# Altium schematic sheet GT_16u2_Rev2.SchDoc
size A
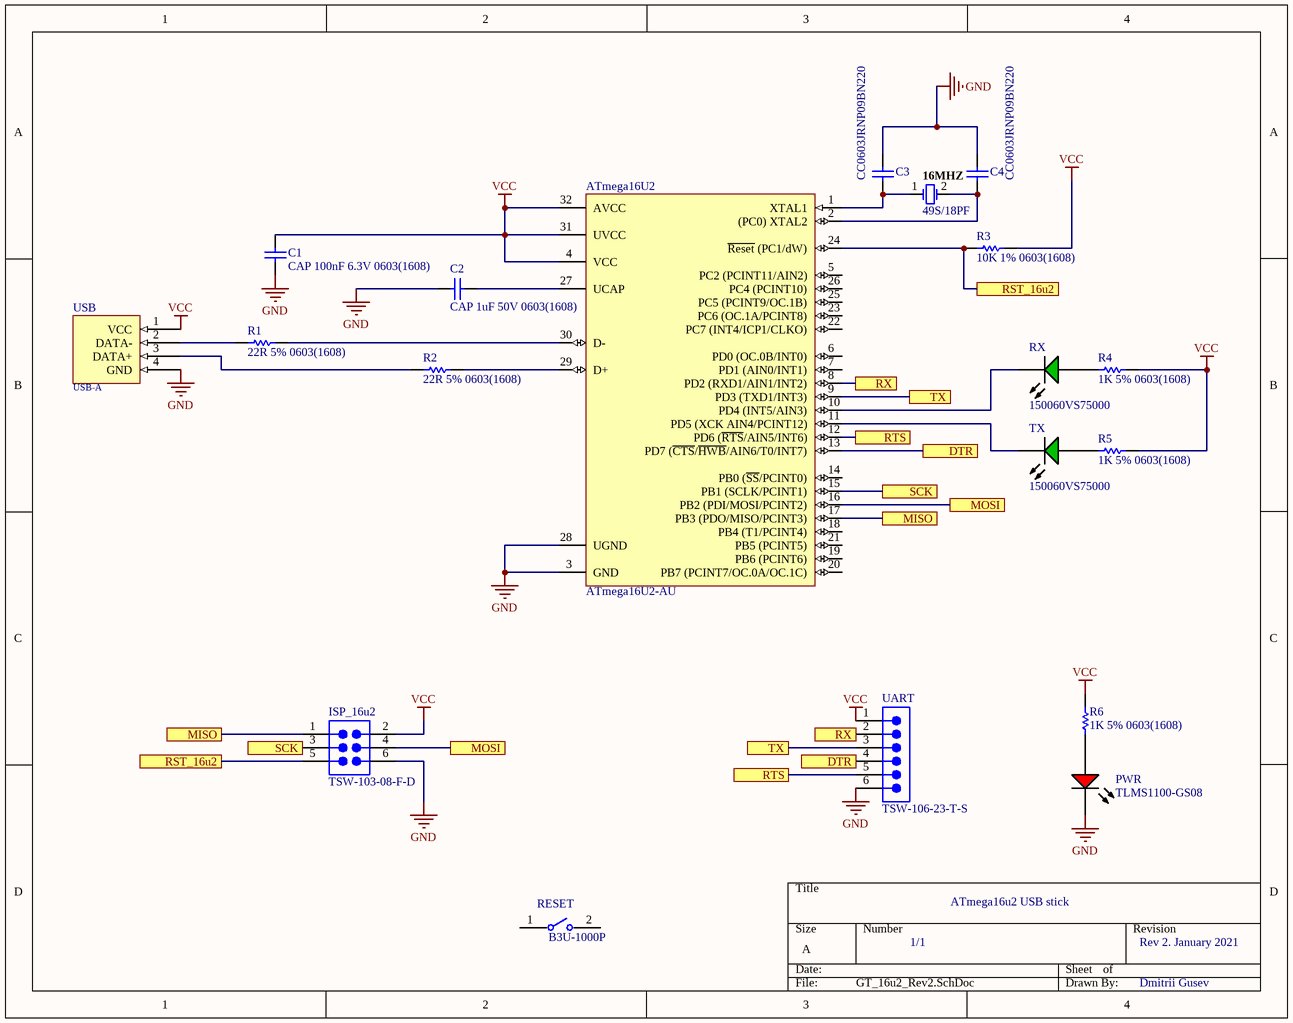
[diagram p0: GT_16u2_Rev2.SchDoc]

## Parts
16MHZ  49S/18PF  [JPY-49S-18PF]
ATmega16U2  ATmega16U2-AU  [32A_M]
C1  CAP 100nF 6.3V 0603(1608)  [CAPC0603(1608)100_L]
C2  CAP 1uF 50V 0603(1608)  [CAPC0603(1608)100_N]
C3  CC0603JRNP09BN220  [CAPC1608X90X40ML10T20]
C4  CC0603JRNP09BN220  [CAPC1608X90X40ML10T20]
ISP_16u2  TSW-103-08-F-D  [SMTC-TSW-103-08-X-D]
PWR  TLMS1100-GS08  [VISH-TLMX1100_V]
R1  22R 5% 0603(1608)  [RESC0603(1608)_N]
R2  22R 5% 0603(1608)  [RESC0603(1608)_N]
R3  10K 1% 0603(1608)  [RESC0603(1608)_N]
R4  1K 5% 0603(1608)  [RESC0603(1608)_L]
R5  1K 5% 0603(1608)  [RESC0603(1608)_L]
R6  1K 5% 0603(1608)  [RESC0603(1608)_L]
RESET  B3U-1000P  [FP-B3U-1000P-MFG]
RX  150060VS75000  [WE-150060VS75000_V]
TX  150060VS75000  [WE-150060VS75000_V]
UART  TSW-106-23-T-S  [SMTC-TSW-106-23-X-S]
USB  USB-A  [USB A]

## Ports
DTR, MISO, MOSI, RST_16u2, RTS, RX, SCK, TX

## Nets
GND: ATmega16U2.3(GND) ATmega16U2.28(UGND) C1.1 C2.1 C3.2 C4.2 ISP_16u2.6 PWR.2(K) UART.6 USB.4(GND)
VCC: ATmega16U2.4(VCC) ATmega16U2.31(UVCC) ATmega16U2.32(AVCC) C1.2 ISP_16u2.2 R3.2 R4.2 R5.2 R6.2 UART.1 USB.1(VCC)
DTR: ATmega16U2.13(PD7_(~{CTS}/~{HWB}/AIN6/T0/INT7)) UART.4 ; port DTR
MISO: ATmega16U2.17(PB3_(PDO/MISO/PCINT3)) ISP_16u2.1 ; port MISO
MOSI: ATmega16U2.16(PB2_(PDI/MOSI/PCINT2)) ISP_16u2.4 ; port MOSI
RST_16u2: ATmega16U2.24(~{Reset}_(PC1/dW)) ISP_16u2.5 R3.1 ; port RST_16u2
RTS: ATmega16U2.12(PD6_(~{RTS}/AIN5/INT6)) UART.5 ; port RTS
RX: ATmega16U2.8(PD2_(RXD1/AIN1/INT2)) UART.2 ; port RX
SCK: ATmega16U2.15(PB1_(SCLK/PCINT1)) ISP_16u2.3 ; port SCK
TX: ATmega16U2.9(PD3_(TXD1/INT3)) UART.3 ; port TX
Net16MHZ_1: 16MHZ.1 ATmega16U2.1(XTAL1) C3.1
Net16MHZ_2: 16MHZ.2 ATmega16U2.2((PC0)_XTAL2) C4.1
NetATmega16U2_10: ATmega16U2.10(PD4_(INT5/AIN3)) RX.1(K)
NetATmega16U2_11: ATmega16U2.11(PD5_(XCK_AIN4/PCINT12)) TX.1(K)
NetATmega16U2_27: ATmega16U2.27(UCAP) C2.2
NetATmega16U2_29: ATmega16U2.29(D+) R2.2
NetATmega16U2_30: ATmega16U2.30(D-) R1.2
NetPWR_1: PWR.1(A) R6.1
NetR1_1: R1.1 USB.2(DATA-)
NetR2_1: R2.1 USB.3(DATA+)
NetR4_1: R4.1 RX.2(A)
NetR5_1: R5.1 TX.2(A)

Not connected (* = marked no-connect by the designer): ATmega16U2 5(PC2_(PCINT11/AIN2)) 6(PD0_(OC.0B/INT0)) 7(PD1_(AIN0/INT1)) 14(PB0_(~{SS}/PCINT0)) 18(PB4_(T1/PCINT4)) 19(PB6_(PCINT6)) 20(PB7_(PCINT7/OC.0A/OC.1C)) 21(PB5_(PCINT5)) 22(PC7_(INT4/ICP1/CLKO)) 23(PC6_(OC.1A/PCINT8)) 25(PC5_(PCINT9/OC.1B)) 26(PC4_(PCINT10)); RESET 1 2

## Notes on the sheet
- ATmega16u2 USB stick
- 1/1
- Rev 2. January 2021
- Dmitrii Gusev

## Library data of the parts
16MHZ = CMP-2100-03581-1: Crystal, 16 MHz, 18 pF, -20 to 70 degC, 2-Pin THD; Manufacturer: Shenzhen Jingpengyuan; Package Description: 2-Pin Through Hole Device, Body 11.05 x 4.65 mm, Pitch 4.88 mm; Package Reference: 49S-18PF; Datasheet Version: 41852.0; Datasheet URL: http://datasheet.octopart.com/49S-18PF-Xinhunjing-datasheet-30677139.pdf; Manufacturer URL: http://www.chjiahui.com/
ATmega16U2 = CMP-0095-00303-2: 8-bit AVR Microcontroller, 2.7-5.5V, 16KB Flash, 512 Bytes EEPROM, 512 Bytes SRAM, 32-pin TQFP, Industrial Grade (-40°C to 85°C); PackageDescription: 32-Lead, 7x7x1.0 mm Body, 0.8mm Lead Pitch, Thin Profile Plastic Quad Flat Package (TQFP); ComponentLink1URL: http://www.atmel.com/; PackageReference: 32A; ComponentLink1Description: Manufacturer URL; DatasheetVersion: revD, Nov-2010; ComponentLink2URL: http://www.atmel.com/dyn/resources/prod_documents/doc7799.pdf; ComponentLink3URL: http://www.atmel.com/dyn/resources/prod_documents/7799S.pdf; ComponentLink3Description: ATmega8U2/16U2/32U2 Summary; ComponentLink2Description: ATmega8U2/16U2/32U2 Datasheet; Code_JEDEC: MS-026-ABA; RevisionNote: DatasheetVersion & PackageVersion updated. URLs added.; PackageVersion: revC, Oct-2010
C1 = CMP-1035-02577-1: CAP 100nF 6.3V ±20% 0603 (1608 Metric) Thickness 1mm SMD; Case-EIA: 0603; Case-Metric: 1608; Tolerance: Â±20%; Technology: SMT; Rated Voltage: 6.3 V; Value: 100nF; Max Thickness: 1 mm
C2 = CMP-1035-02746-1: CAP 1uF 50V ±20% 0603 (1608 Metric) Thickness 1mm SMD; Tolerance: Â±20%; Case-EIA: 0603; Case-Metric: 1608; Value: 1uF; Technology: SMT; Max Thickness: 1 mm; Rated Voltage: 50 V
C3 C4 = CMP-1659-00006-3: Chip Capacitor, 22 pF, +/- 5%, 50 V, -55 to 125 degC, 0603 (1608 Metric), RoHS, Tape and Reel; Mount: Surface Mount; PackageReference: 0603; DatasheetVersion: Rev. 13, 05/2016; RoHSCompliant: true; PackageDescription: 2-Pin Surface Mount Device, Body 1.6 x 0.8 mm; Min Operating Temperature: -55 degC; Length: 1.6 mm; Mounting Technology: Surface Mount; Max Operating Temperature: 125 degC
ISP_16u2 = CMP-1024-00337-1: Manufacturer: Samtec; Pitch: 2.54 mm; ComponentLink1URL: http://www.samtec.com; PackageReference: TSW-103-08-X-D; ComponentLink3Description: Package Specification; PackageDescription: .025[0.64] SQ. Post Terminal Strip Assembly; PartNumber: TSW-103-08-F-D; DatasheetVersion: F-214; ComponentLink1Description: Manufacturer URL; ComponentLink2Description: Datasheet; ComponentLink2URL: http://www.samtec.com/documents/webfiles/pdf/TSW_TH.PDF; PackageVersion: DM, 8/1988; Orientation: Vertical; Mounting Technology: Through-hole; RoHS: True; Temperature Range: -55 to 125 degC; ComponentLink3URL: http://www.samtec.com/documents/webfiles/cpdf/TSW-XXX-XX-XXX-X-XX-XXX-MKT.pdf
PWR = CMP-1666-00027-1: LED, RED, 2.1 V, -40 to 100 degC, 2-Pin SMD (0603), RoHS, Tape and Reel; Type (Capacitors): C0G; Resistance: 100000000000 Ohm; Capacitance: 12 pF; Voltage Rating: 50 V; Tolerance: 5%; Min Operating Temperature: -55degC; REACH SVHC: No SVHC; ComponentLink2Description: Datasheet; ComponentLink1URL: http://www.vishay.com/; Width: 0.8 mm; Package Quantity: 4000; PackageReference: TLMX1100; ComponentLink2URL: http://www.vishay.com/docs/83173/tlmb1100.pdf; Case/Package: 0603; Case Code (Metric): 1608; Packaging: Tape and Reel; Pins: 2; ComponentLink1Description: Manufacturer URL; Max Operating Temperature: 125degC; Height: 0.8 mm; Length: 1.6 mm; Mount: Surface Mount; PackageDescription: 2-Pin Surface Mount Device, Body 1.6 x 0.8 mm; DatasheetVersion: Rev. 2.7, 03/2016; Case Code (Imperial): 0603; Voltage Rating (DC): 50 V; RoHSCompliant: True; Radiation Hardening: No
R1 R2 = CMP-1012-00034-1: 22R 0.1W 5% 0603 (1608 Metric)  SMD; Value: 22.00 Ohm; Case-EIA: 0603; Case-Metric: 1608; Technology: SMT; Power: 0.1 W; Tolerance: 5 %
R3 = CMP-1012-00623-1: 10K 0.1W 1% 0603 (1608 Metric)  SMD; Value: 10000.00 Ohm; Case-EIA: 0603; Case-Metric: 1608; Power: 0.1 W; Tolerance: 1 %; Technology: SMT
R4-R6 = CMP-1012-00074-1: 1K 0.1W 5% 0603 (1608 Metric)  SMD; Case-EIA: 0603; Case-Metric: 1608; Value: 1000.00 Ohm; Technology: SMT; Tolerance: 5 %; Power: 0.1 W
RESET = CMP-2100-03586-2: SWITCH TACTILE SPST-NO 0.05A 12V; Contact Resistance: 100mR; Operating Force: 1.5N; Max Current Rating: 50mA; Switch Travel: 0.15mm; Actuator Type: Standard; Mechanical Life: 200000Cycles; Ratings: Dust Proof; Illumination Type: Non-Illuminated; Throw Configuration: SPST; Actuator Length: 0.4mm; Switch Function: Off-Mom; Height: 1.2mm; Width: 3mm; Weight: 0.000776oz; Contact Material: Silver; Max Voltage Rating (DC): 12V; Insulation Resistance: 100MR; Lead Free: Lead Free; Current Rating: 50mA; Termination: SMD/SMT; Length: 4mm; Voltage Rating (DC): 12V; Contact Current Rating: 50mA; Orientation: Straight; Depth: 2.5mm; Max Operating Temperature: 70°C; Packaging: Tape and Reel; Min Operating Temperature: -25°C; Package Quantity: 1; Mount: Surface Mount; Electrical Life: 200000Cycles
RX TX = CMP-1712-00001-2: WL-SMCW SMD Chip LED Top View Monocolor Waterclear, 30 mA, 2 V, -40 to 85 degC, 2-Pin SMD, RoHS, Tape and Reel; Lens Type: Clear; Voltage - Forward (Vf) (Typ): 2V; Lens Style/Size: Rectangle with Flat Top, 1.1mm x 0.7mm; Millicandela Rating: 40mcd; Wavelength - Peak: 572nm; Viewing Angle: 140°; Dynamic Catalog: 0603 Rectangle with Flat Top Chip LEDs; Other Names: 732-4980-1; Wavelength - Dominant: 570nm; 3D Model: SMCW_0603.igs / SMCW_0603.stp / SMCW_0603.wrl; Current - Test: 20mA; Size / Dimension: 1.60mm L x 0.80mm W; Height: 0.70mm; Mounting Technology: Surface Mount; PartNumber: 150060VS75000; ComponentLink2Description: Datasheet; Series: WL-SMCW; DatasheetVersion: Rev. 2.7; Category: Optoelectronics; Mounting Type: Surface Mount; Standard Package: 1; PackageDescription: 2-Pin Surface Mount Device, Body 1.6 x 0.8 mm; ComponentLink1Description: Manufacturer URL; Family: LED Indication - Discrete; Online Catalog: 0603 Rectangle with Flat Top Chip LEDs; Color: Green; ComponentLink1URL: https://www.we-online.com/; ComponentLink2URL: http://katalog.we-online.de/led/datasheet/150060VS75000.pdf; Package / Case: 0603 (1608 Metric); Packaging: Cut Tape (CT)
UART = CMP-1024-00395-1: Manufacturer: Samtec; Pitch: 2.54 mm; PackageReference: TSW-106-23-X-S; ComponentLink1URL: http://www.samtec.com; ComponentLink1Description: Manufacturer URL; PackageVersion: DM, 8/1988; ComponentLink2Description: Datasheet; Mounting Technology: Through-hole; Orientation: Vertical; ComponentLink2URL: http://www.samtec.com/documents/webfiles/pdf/TSW_TH.PDF; PackageDescription: .025[0.64] SQ. Post Terminal Strip Assembly; ComponentLink3Description: Package Specification; RoHS: True; DatasheetVersion: F-214; Temperature Range: -55 to 105 degC; PartNumber: TSW-106-23-T-S; ComponentLink3URL: http://www.samtec.com/documents/webfiles/cpdf/TSW-XXX-XX-XXX-X-XX-XXX-MKT.pdf